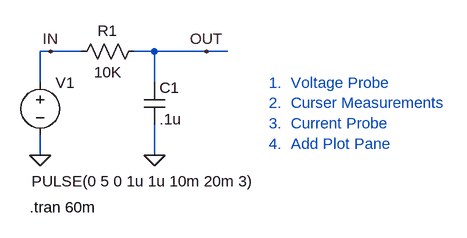
[diagram p0: schematic RCFilterTimeDomain.asc]
RCFilterTimeDomain.asc, the LTspice schematic file:
Version 4
SHEET 1 880 680
WIRE 32 160 16 160
WIRE 80 160 32 160
WIRE 192 160 160 160
WIRE 272 160 192 160
WIRE 304 160 272 160
WIRE 16 208 16 160
WIRE 192 208 192 160
WIRE 16 320 16 288
WIRE 192 320 192 272
FLAG 192 320 0
FLAG 16 320 0
FLAG 272 160 OUT
FLAG 32 160 IN
SYMBOL res 176 144 R90
WINDOW 0 0 56 VBottom 2
WINDOW 3 32 56 VTop 2
SYMATTR InstName R1
SYMATTR Value 10K
SYMBOL cap 176 208 R0
SYMATTR InstName C1
SYMATTR Value .1u
SYMBOL voltage 16 192 R0
WINDOW 3 -13 168 Left 2
WINDOW 123 0 0 Left 2
WINDOW 39 0 0 Left 2
SYMATTR Value PULSE(0 5 0 1u 1u 10m 20m 3)
SYMATTR InstName V1
TEXT 0 400 Left 2 !.tran 60m
TEXT 368 208 Left 2 ;1.  Voltage Probe\n2.  Curser Measurements\n3.  Current Probe\n4.  Add Plot Pane

The netlist it stands for:
* RCFilterTimeDomain.asc
R1 OUT IN 10K
C1 OUT 0 .1u
V1 IN 0 PULSE(0 5 0 1u 1u 10m 20m 3)
.tran 60m
* 1.  Voltage Probe
* 2.  Curser Measurements
* 3.  Current Probe
* 4.  Add Plot Pane
.backanno
.end